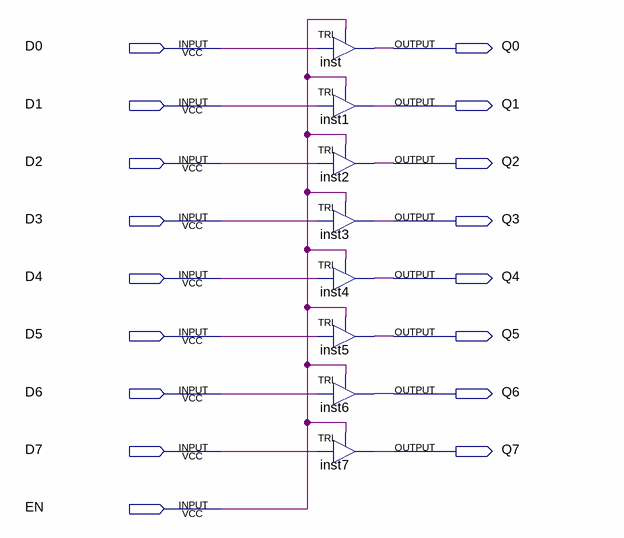
[diagram p0: schematic sheet]
// Quartus schematic Tri8.bdf as structural Verilog: 8 symbols, 17 pins
module Tri8 (
  input  D0,
  input  D1,
  input  D2,
  input  D3,
  input  D4,
  input  D5,
  input  D6,
  input  D7,
  input  EN,
  output Q0,
  output Q1,
  output Q2,
  output Q3,
  output Q4,
  output Q5,
  output Q6,
  output Q7
);

  TRI inst (.IN(D0), .OE(EN), .OUT(Q0));
  TRI inst1 (.IN(D1), .OE(EN), .OUT(Q1));
  TRI inst2 (.IN(D2), .OE(EN), .OUT(Q2));
  TRI inst3 (.IN(D3), .OE(EN), .OUT(Q3));
  TRI inst4 (.IN(D4), .OE(EN), .OUT(Q4));
  TRI inst5 (.IN(D5), .OE(EN), .OUT(Q5));
  TRI inst6 (.IN(D6), .OE(EN), .OUT(Q6));
  TRI inst7 (.IN(D7), .OE(EN), .OUT(Q7));
endmodule
